# Altium schematic sheet eps_batt.SchDoc
size A4
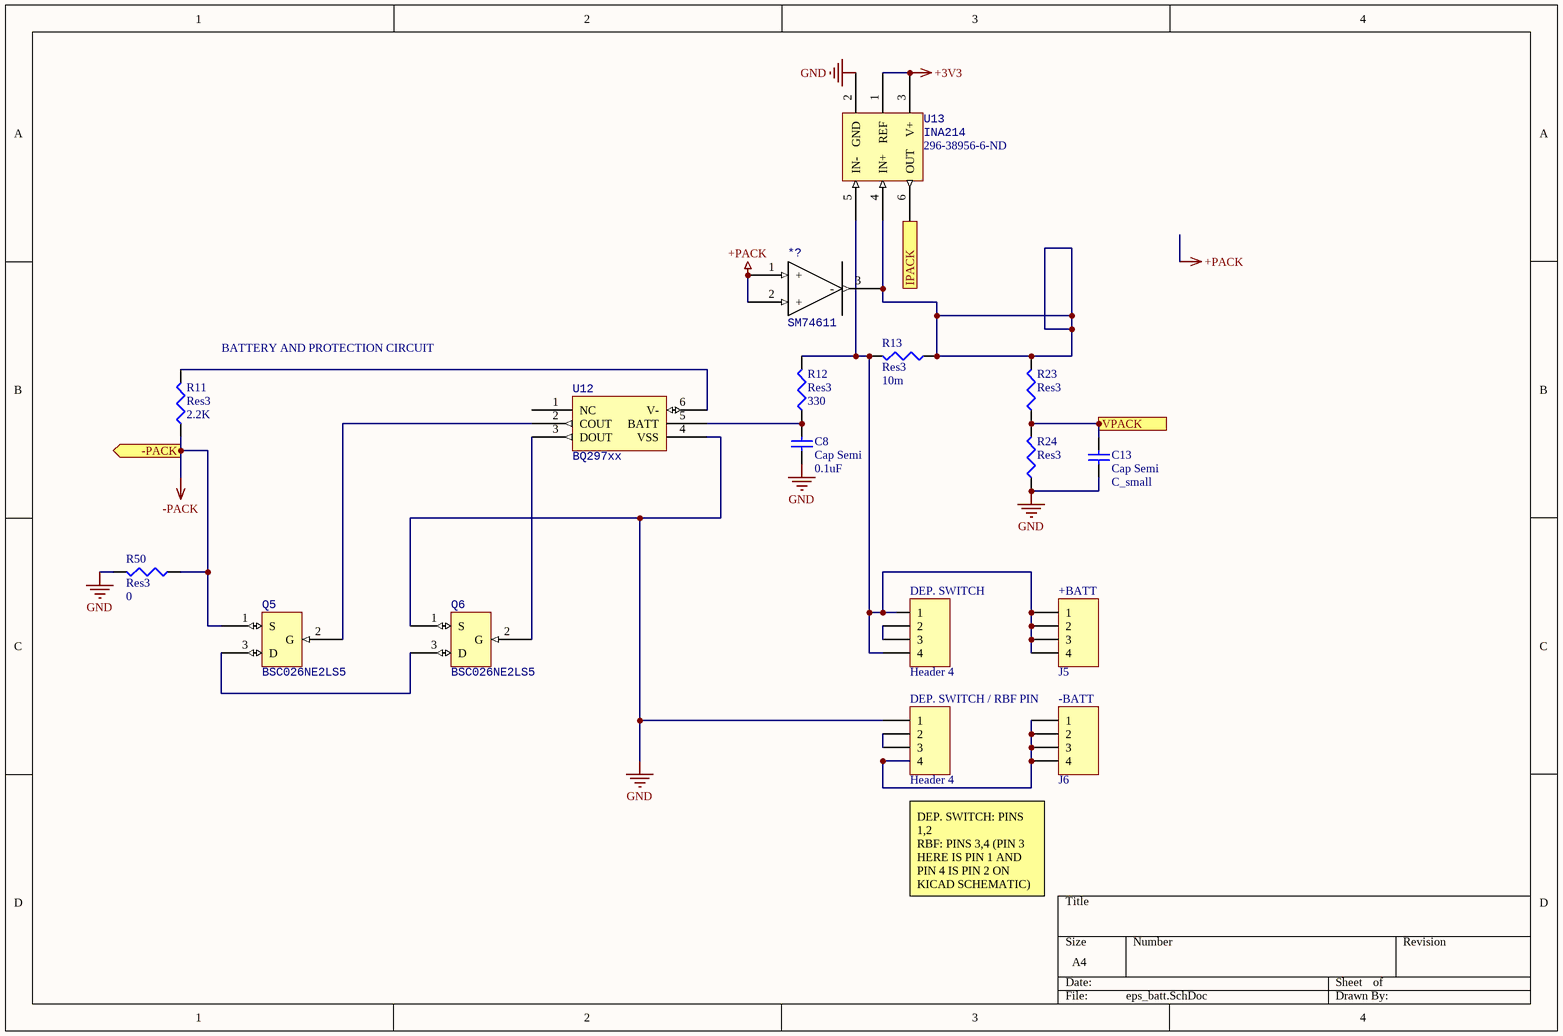
[diagram p0: eps_batt.SchDoc]

## Parts
*?  SM74611  [TO254P1435X464-3N]
+BATT  J5  [DF14-4P-1.25H(55)]
-BATT  J6  [DF14-4P-1.25H(55)]
C8  Cap Semi  value 0.1uF  [1608[0603]]
C13  Cap Semi  value C_small  [1608[0603]]
DEP._SWITCH  Header 4  [DF14-4P-1.25H(55)]
DEP._SWITCH_/_RBF_PIN  Header 4  [DF14-4P-1.25H(55)]
Q5  BSC026NE2LS5  [INF-PG-TDSON-8-1_V]
Q6  BSC026NE2LS5  [INF-PG-TDSON-8-1_V]
R11  Res3  value 2.2K  [J1-0603]
R12  Res3  value 330  [J1-0603]
R13  Res3  value 10m  [J1-0603]
R23  Res3  [J1-0603]
R24  Res3  [J1-0603]
R50  Res3  value 0  [J1-0603]
U12  BQ297xx  [SON50P150X150X80-6N - duplicate1]
U13  INA214  Supplier Part Number 1: 296-38956-6-ND  [SOT65P210X110-6N]

## Ports
-PACK (out), IPACK (out), VPACK (in)

## Nets
+3V3: U13.1(REF) U13.3(V+)
+PACK: *?.1(+) *?.2(+)
-PACK: Q5.1(S) R11.1 R50.1 ; port -PACK
GND: C8.1 C13.1 DEP._SWITCH_/_RBF_PIN.1 Q6.1(S) R24.1 R50.2 U12.4(VSS) U13.2(GND)
IPACK: U13.6(OUT) ; port IPACK
VPACK: C13.2 R23.1 R24.2 ; port VPACK
Net*?_3: *?.3(-) R13.1 R23.2 U13.4(IN+)
Net+BATT_1: +BATT.1 +BATT.2 +BATT.3 +BATT.4 DEP._SWITCH.1 DEP._SWITCH.4 R12.2 R13.2 U13.5(IN-)
Net-BATT_1: -BATT.1 -BATT.2 -BATT.3 -BATT.4 DEP._SWITCH_/_RBF_PIN.4
NetC8_2: C8.2 R12.1 U12.5(BATT)
NetDEP._SWITCH_2: DEP._SWITCH.2 DEP._SWITCH.3
NetDEP._SWITCH_/_RBF_PIN_2: DEP._SWITCH_/_RBF_PIN.2 DEP._SWITCH_/_RBF_PIN.3
NetQ5_2: Q5.2(G) U12.2(COUT)
NetQ5_3: Q5.3(D) Q6.3(D)
NetQ6_2: Q6.2(G) U12.3(DOUT)
NetR11_2: R11.2 U12.6(V-)

Not connected (* = marked no-connect by the designer): U12 1(NC)

## Notes on the sheet
- (near R11) BATTERY AND PROTECTION CIRCUIT
- DEP. SWITCH: PINS 1,2
  RBF: PINS 3,4 (PIN 3 HERE IS PIN 1 AND PIN 4 IS PIN 2 ON KICAD SCHEMATIC)

## Library data of the parts
*? = SM74611: PV Diode
+BATT -BATT DEP._SWITCH DEP._SWITCH_/_RBF_PIN = Header 4: Header, 4-Pin; LatestRevisionDate: 17-Jul-2002; LatestRevisionNote: Re-released for DXP Platform.; Publisher: Altium Limited; ComponentLink1Description: Hirose DF14-4P-1.25H(55) Right Angle; ComponentLink1URL: https://www.digikey.ca/product-detail/en/hirose-electric-co-ltd/DF14-4P-1.25H-55/H10317-ND/964472
C8 C13 = Cap Semi: Capacitor (Semiconductor SIM Model); Published: 8-Jun-2000; LatestRevisionDate: 29-May-2009; LatestRevisionNote: IPC-7351 Footprint Added.; PackageReference: C1206; Publisher: Altium Limited; PackageDescription: Chip Capacitor
Q5 Q6 = BSC026NE2LS5: MOSFET; ComponentLink1Description: N-Channel Mosfet; ComponentLink1URL: https://www.digikey.ca/product-detail/en/infineon-technologies/BSC026NE2LS5ATMA1/BSC026NE2LS5ATMA1DKR-ND/6564538
R11-R13 R23 R24 R50 = Res3: Resistor; Published: 8-Jun-2000; LatestRevisionDate: 29-May-2009; LatestRevisionNote: IPC-7351 Footprint Added.; PackageReference: J1-0603; Publisher: Altium Limited; PackageDescription: Chip Resistor
U12 = BQ2972: Battery protection; ComponentLink1Description: Charge Controller; ComponentLink1URL: https://www.digikey.com/product-detail/en/texas-instruments/BQ29729DSET/296-44131-1-ND/6005144
U13 = INA214: Current monitor; Supplier 1: Digi-Key; ComponentLink1Description: IC Current Monitor; ComponentLink1URL: https://www.digikey.ca/product-detail/en/texas-instruments/INA214AIDCKR/296-38956-1-ND/5143051